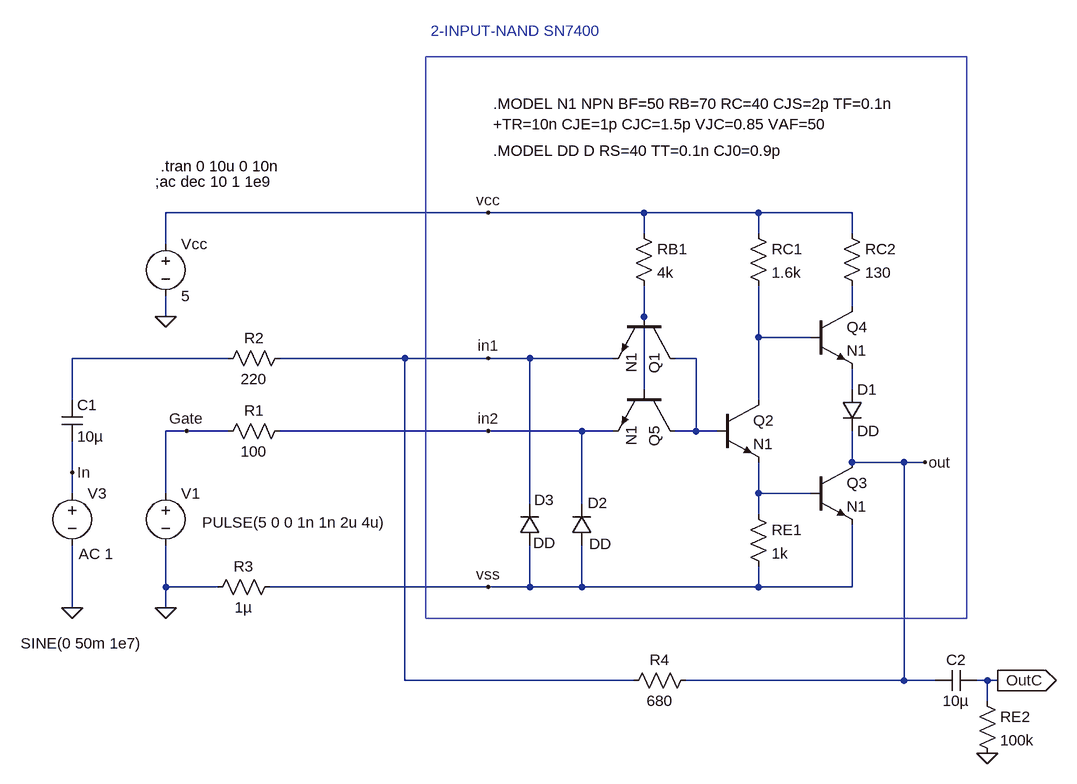
[diagram p0: schematic TTL_LinTest.asc]
TTL_LinTest.asc, the LTspice schematic file:
Version 4
SHEET 1 880 724
WIRE -960 160 -960 96
WIRE -960 272 -960 224
WIRE -960 304 -960 272
WIRE -960 480 -960 384
WIRE -816 -80 -816 -128
WIRE -816 32 -816 0
WIRE -816 304 -816 208
WIRE -816 448 -816 384
WIRE -816 480 -816 448
WIRE -784 208 -816 208
WIRE -736 448 -816 448
WIRE -720 96 -960 96
WIRE -720 208 -784 208
WIRE -448 96 -640 96
WIRE -448 592 -448 96
WIRE -320 -128 -816 -128
WIRE -320 96 -448 96
WIRE -320 208 -640 208
WIRE -320 448 -656 448
WIRE -256 96 -320 96
WIRE -256 320 -256 96
WIRE -256 448 -320 448
WIRE -256 448 -256 384
WIRE -176 208 -320 208
WIRE -176 320 -176 208
WIRE -176 448 -256 448
WIRE -176 448 -176 384
WIRE -128 96 -256 96
WIRE -128 208 -176 208
WIRE -96 592 -448 592
WIRE -80 -128 -320 -128
WIRE -80 -96 -80 -128
WIRE -80 32 -80 -16
WIRE -80 144 -80 32
WIRE 0 96 -32 96
WIRE 0 208 -32 208
WIRE 0 208 0 96
WIRE 32 208 0 208
WIRE 96 -128 -80 -128
WIRE 96 -96 96 -128
WIRE 96 64 96 -16
WIRE 96 160 96 64
WIRE 96 304 96 256
WIRE 96 336 96 304
WIRE 96 448 -176 448
WIRE 96 448 96 416
WIRE 176 64 96 64
WIRE 176 304 96 304
WIRE 240 -128 96 -128
WIRE 240 -96 240 -128
WIRE 240 16 240 -16
WIRE 240 144 240 112
WIRE 240 256 240 208
WIRE 240 448 96 448
WIRE 240 448 240 352
WIRE 320 256 240 256
WIRE 320 592 -16 592
WIRE 320 592 320 256
WIRE 352 256 320 256
WIRE 368 592 320 592
WIRE 448 592 432 592
WIRE 448 624 448 592
WIRE 464 592 448 592
FLAG -816 480 0
FLAG -816 32 0
FLAG 352 256 out
FLAG -320 96 in1
FLAG -320 208 in2
FLAG -320 -128 vcc
FLAG -320 448 vss
FLAG -960 480 0
FLAG 464 592 OutC
IOPIN 464 592 Out
FLAG 448 704 0
FLAG -960 272 In
FLAG -784 208 Gate
SYMBOL npn -32 32 R90
SYMATTR InstName Q1
SYMATTR Value N1
SYMBOL npn 32 160 R0
SYMATTR InstName Q2
SYMATTR Value N1
SYMBOL npn 176 256 R0
SYMATTR InstName Q3
SYMATTR Value N1
SYMBOL npn 176 16 R0
SYMATTR InstName Q4
SYMATTR Value N1
SYMBOL diode 224 144 R0
SYMATTR InstName D1
SYMATTR Value DD
SYMBOL res 80 -112 R0
SYMATTR InstName RC1
SYMATTR Value 1.6k
SYMBOL res 224 -112 R0
SYMATTR InstName RC2
SYMATTR Value 130
SYMBOL res -96 -112 R0
SYMATTR InstName RB1
SYMATTR Value 4k
SYMBOL res 80 320 R0
SYMATTR InstName RE1
SYMATTR Value 1k
SYMBOL npn -32 144 R90
SYMATTR InstName Q5
SYMATTR Value N1
SYMBOL voltage -816 288 R0
WINDOW 123 0 0 Left 0
WINDOW 39 0 0 Left 0
WINDOW 3 56 61 Left 0
SYMATTR Value PULSE(5 0 0 1n 1n 2u 4u)
SYMATTR InstName V1
SYMBOL res -736 224 R270
WINDOW 0 32 56 VTop 0
WINDOW 3 0 56 VBottom 0
SYMATTR InstName R1
SYMATTR Value 100
SYMBOL voltage -816 -96 R0
SYMATTR InstName Vcc
SYMATTR Value 5
SYMBOL res -736 112 R270
WINDOW 0 32 56 VTop 0
WINDOW 3 0 56 VBottom 0
SYMATTR InstName R2
SYMATTR Value 220
SYMBOL res -752 464 R270
WINDOW 0 32 56 VTop 0
WINDOW 3 0 56 VBottom 0
SYMATTR InstName R3
SYMATTR Value 1µ
SYMBOL diode -160 384 R180
WINDOW 0 -24 65 Left 0
WINDOW 3 -30 2 Left 0
SYMATTR InstName D2
SYMATTR Value DD
SYMBOL diode -240 384 R180
WINDOW 0 -22 70 Left 0
WINDOW 3 -24 4 Left 0
SYMATTR InstName D3
SYMATTR Value DD
SYMBOL voltage -960 288 R0
WINDOW 123 10 109 Left 0
WINDOW 39 0 0 Left 0
WINDOW 3 -79 247 Left 0
SYMATTR Value2 AC 1
SYMATTR Value SINE(0 50m 1e7)
SYMATTR InstName V3
SYMBOL res -112 608 R270
WINDOW 0 32 56 VTop 0
WINDOW 3 0 56 VBottom 0
SYMATTR InstName R4
SYMATTR Value 680
SYMBOL cap -976 160 R0
SYMATTR InstName C1
SYMATTR Value 10µ
SYMATTR SpiceLine V=6.3 Irms=0 Rser=0.001 MTBF=0 Lser=0 mfg="TDK" pn="C3216X5ROJ106M" type="X5R" ppPkg=1
SYMBOL cap 432 576 R90
WINDOW 0 0 32 VBottom 0
WINDOW 3 32 32 VTop 0
SYMATTR InstName C2
SYMATTR Value 10µ
SYMBOL res 432 608 R0
SYMATTR InstName RE2
SYMATTR Value 100k
TEXT -312 -296 Left 0 !.MODEL N1 NPN BF=50 RB=70 RC=40 CJS=2p TF=0.1n\n+TR=10n CJE=1p CJC=1.5p VJC=0.85 VAF=50
TEXT -312 -224 Left 0 !.MODEL DD D RS=40 TT=0.1n CJ0=0.9p
TEXT -824 -200 Left 0 !.tran 0 10u 0 10n
TEXT -408 -408 Left 0 ;2-INPUT-NAND SN7400
TEXT -832 -176 Left 0 !;ac dec 10 1 1e9
RECTANGLE Normal 416 496 -416 -368

The netlist it stands for:
* TTL_LinTest.asc
Q1 N003 N002 in1 0 N1
Q2 N004 N003 N005 0 N1
Q3 out N005 vss 0 N1
Q4 N006 N004 N007 0 N1
D1 N007 out DD
RC1 vcc N004 1.6k
RC2 vcc N006 130
RB1 vcc N002 4k
RE1 N005 vss 1k
Q5 N003 N002 in2 0 N1
V1 Gate 0 PULSE(5 0 0 1n 1n 2u 4u)
R1 Gate in2 100
Vcc vcc 0 5
R2 N001 in1 220
R3 0 vss 1µ
D2 vss in2 DD
D3 vss in1 DD
V3 In 0 SINE(0 50m 1e7) AC 1
R4 in1 out 680
C1 N001 In 10µ V=6.3 Irms=0 Rser=0.001 MTBF=0 Lser=0 mfg="TDK" pn="C3216X5ROJ106M" type="X5R" ppPkg=1
C2 OutC out 10µ
RE2 OutC 0 100k
.model D D
.lib standard.dio
.model NPN NPN
.model PNP PNP
.lib standard.bjt
.MODEL N1 NPN BF=50 RB=70 RC=40 CJS=2p TF=0.1n
+TR=10n CJE=1p CJC=1.5p VJC=0.85 VAF=50
.MODEL DD D RS=40 TT=0.1n CJ0=0.9p
.tran 0 10u 0 10n
* 2-INPUT-NAND SN7400
;ac dec 10 1 1e9
.backanno
.end